# Altium schematic sheet CHECK_BATTERY.SchDoc
size A4; SheetNumber: 5; SheetTotal: 6
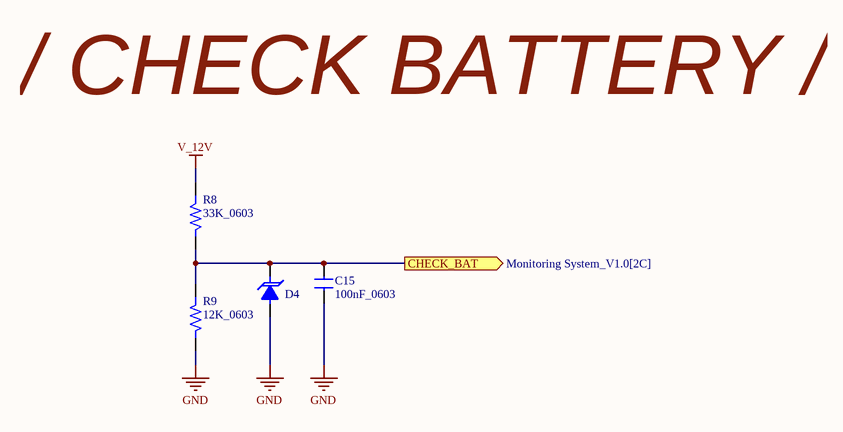
[diagram p0: CHECK_BATTERY.SchDoc]

## Parts
C15  100nF_0603  [CN-SMD-0603]
D4  SMBJ5.0A_KE  [SMB]  (value not drawn)
R8  33K_0603  [RES-SMD-0603]
R9  12K_0603  [RES-SMD-0603]

## Ports
CHECK_BAT (out, see Monitoring System_V1.0[2C])

## Nets
GND: C15.1 D4.1(A) R9.1
V_12V: R8.2
CHECK_BAT: C15.2 D4.2(K) R8.1 R9.2 ; port CHECK_BAT

## Notes on the sheet
- / CHECK BATTERY /

## Library data of the parts
C15 = CAP 0603 104: Cap SMD, 0.06x0.03 inch, 1.55x0.85 mm - 1608
D4 = Diode SMBJ5.0A: TVS Diode, Vrrm =5.0V, Vcl = 9.2V; Code - JEDEC: DO-214-AB; Value: 1N5007; Published: 8-Jun-2000; Revision: July-2002: Re-released for DXP Platform.; Publisher: Altium Limited
R8 = RES 0603 33K: Resistor SMD, 0.06x0.03 inch, 1.55x0.85 mm - 1608, 1/10W
R9 = RES 0603 12K: Resistor SMD, 0.06x0.03 inch, 1.55x0.85 mm - 1608, 1/10W